# Altium schematic sheet HW_Mechanical_Parts.SchDoc: HW Mechanical parts
size A4; SheetNumber: 8; SheetTotal: 8
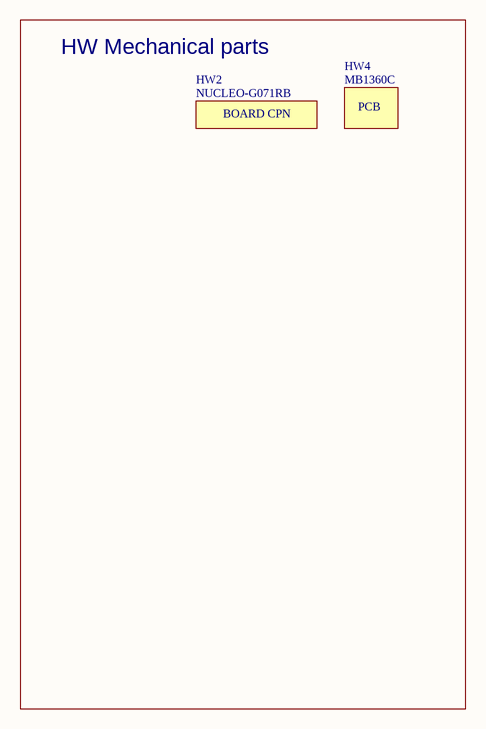
[diagram p0: HW_Mechanical_Parts.SchDoc]

## Parts
HW2  value NUCLEO-G071RB  (hidden comment: STICKER_BOARD_CPN)  (mechanical)
HW4  value MB1360C  (hidden comment: PCB)  (mechanical)

## Blocks framed on the sheet
HW Mechanical parts: HW2 HW4

## Notes on the sheet
- Title:
- Project:
- Size:
- Revision:
- Variant:
- A4
- -
- Date:
- Reference:
- Sheet:
- of
- (in symbol MCD-00549) BOARD CPN

## Library data of the parts
HW2 = MCD-00549: Sticker to mention board CPN code; Part_Type: Mechanical; Provided_By: Subcon; Initial_Board_Reference: mb1319; Internal_Part_Number: MCD-00549; ECCN_US: n/a; ECCN_EU: n/a; Status: Released
HW4 = MCD-00216: PCB, xxxx for PCB number, Y for PCB revision; Part_Type: Mechanical; Provided_By: SUBCO; Internal_Part_Number: MCD-00216; Status: Released; ECCN_US: n/a; ECCN_EU: n/a; Manufacturer_Part_Number: n/a; Manufacturer: n/a; ComponentLink1Description: Datasheet